# EAGLE design TriacSwitch2 (EAGLE 6.1)
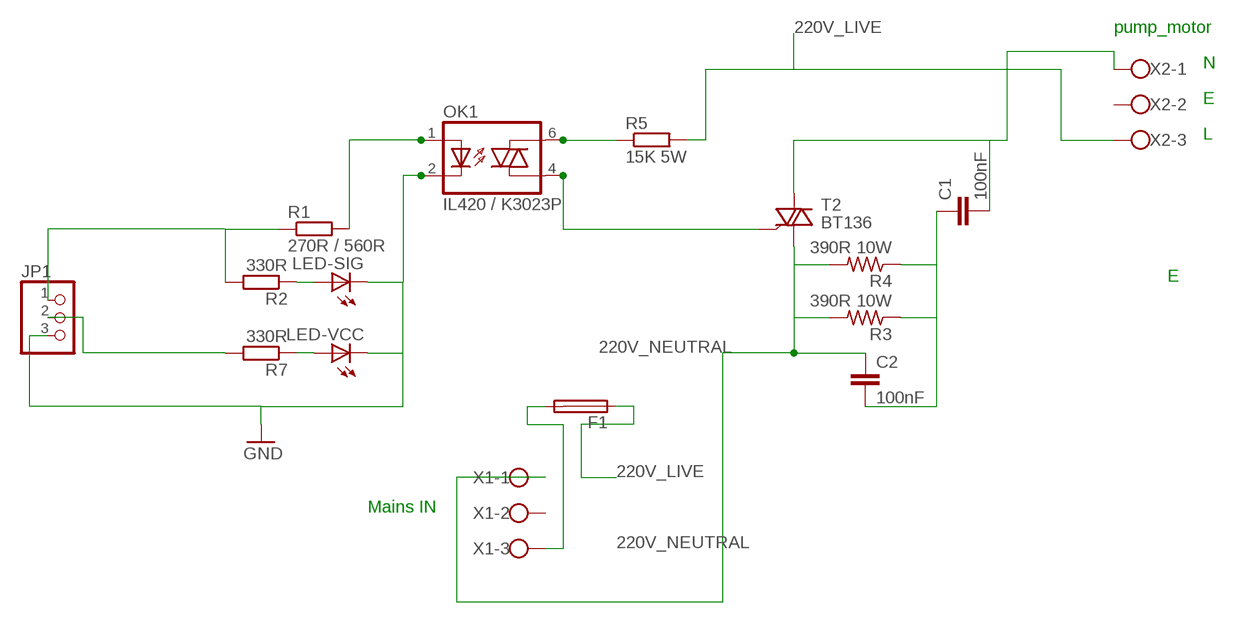
[diagram p0: schematic, sheet 1]

## Parts
C1  100nF  C-EU150-054X183  [C150-054X183]
C2  100nF  C-EU150-054X183  [C150-054X183]
F1  GSH15  [GSH15]
JP1  PINHD-1X3  [1X03]
LED-SIG  LED3MM  [LED3MM]
LED-VCC  LED3MM  [LED3MM]
OK1  IL420 / K3023P  IL420  [DIL06]
R1  270R / 560R  R-EU_0204/7  [0204/7]
R2  330R  R-EU_0204/7  [0204/7]
R3  390R 10W  R-US_0922/22  [0922/22]
R4  390R 10W  R-US_0922/22  [0922/22]
R5  15K 5W  R-EU_0617/22  [0617/22]
R7  330R  R-EU_0204/7  [0204/7]
T2  BT136  [TO220AB]
X1  W237-103  [W237-103]
X2  W237-103  [W237-103]

## Nets
220V_LIVE: F1.1 R5.2 X2.3
220V_NEUTRAL: C2.1 R3.2 R4.2 T2.1(A1) X1.1
GND: JP1.3 LED-SIG.K(C) LED-VCC.K(C) OK1.2(C)
N$1: OK1.4(A1) T2.3(G)
N$2: F1.2 X1.3
N$3: JP1.1 R1.1 R2.2
N$4: LED-SIG.A R2.1
N$6: OK1.6(A2) R5.1
N$7: C1.1 C2.2 R3.1 R4.1
N$8: OK1.1(A) R1.2
N$9: LED-VCC.A R7.1
N$10: JP1.2 R7.2
N$11: C1.2 T2.2(A2) X2.1
Unconnected: X1.2 X2.2

## Notes on the sheet
- pump_motor
- N
- E
- L
- E
- Mains IN

## Library data of the parts
C1 C2 = rcl:C-EU: CAPACITOR, European symbol
F1 = fuse:GSH15: FUSE HOLDER grid 15mm, 19649 Wickmann; MPN: 64900001039; OC_FARNELL: 1271673; OC_NEWARK: 02P0318
JP1 = pinhead:PINHD-1X3: PIN HEADER
LED-SIG LED-VCC = led:LED: LED OSRAM: - CHIPLED LG R971, LG N971, LY N971, LG Q971, LY Q971, LO R971, LY R971 LH N974, LH R974 LS Q976, LO Q976, LY Q976 LO Q996 - Hyper CHIPLED LW Q18S LB Q993, LB Q99A, LB R99A - SideLED LS A670, LO A670, LY A670, LG A670, LP A670 LB A673, LV A673, LT A673, LW A673 LH A674 LY A675 LS A676, LA A676, LO A676, LY A676, LW A676 LS A679, LY A679, LG A679 - Hyper Micro SIDELED® LS Y876, LA Y876, LO Y876, LY Y876 LT Y87S - SmartLED LW L88C, LW L88S LB L89C, LB L89S, LG L890 LS L89K, LO L89K, LY L89K LS L896, LA L896, LO L896, LY L896 - TOPLED LS T670, LO T670, LY T670, LG T670, LP T670 LSG T670, LSP T670, LSY T670, LOP T670, LYG T670 LG T671, LOG T671, LSG T671 LB T673, LV T673, LT T673, LW T673 LH T674 LS T676, LA T676, LO T676, LY T676, LB T676, LH T676, LSB T676, LW T676 LB T67C, LV T67C, LT T67C, LS T67K, LO T67K, LY T67K, LW E67C LS E67B, LA E67B, LO E67B, LY E67B, LB E67C, LV E67C, LT E67C LW T67C LS T679, LY T679, LG T679 LS T770, LO T770, LY T770, LG T770, LP T770 LB T773, LV T773, LT T773, LW T773 LH T774 LS E675, LA E675, LY E675, LS T675 LS T776, LA T776, LO T776, LY T776, LB T776 LHGB T686 LT T68C, LB T68C - Hyper Mini TOPLED® LB M676 - Mini TOPLED Santana® LG M470 LS M47K, LO M47K, LY M47K Source: http://www.osram.convergy.de LUXEON: - LUMILED® LXK2-PW12-R00, LXK2-PW12-S00, LXK2-PW14-U00, LXK2-PW14-V00 LXK2-PM12-R00, LXK2-PM12-S00, LXK2-PM14-U00 LXK2-PE12-Q00, LXK2-PE12-R00, LXK2-PE12-S00, LXK2-PE14-T00, LXK2-PE14-U00 LXK2-PB12-K00, LXK2-PB12-L00, LXK2-PB12-M00, LXK2-PB14-N00, LXK2-PB14-P00, LXK2-PB14-Q00 LXK2-PR12-L00, LXK2-PR12-M00, LXK2-PR14-Q00, LXK2-PR14-R00 LXK2-PD12-Q00, LXK2-PD12-R00, LXK2-PD12-S00 LXK2-PH12-R00, LXK2-PH12-S00 LXK2-PL12-P00, LXK2-PL12-Q00, LXK2-PL12-R00 Source: www.luxeon.com KINGBRIGHT: KA-3528ASYC Source: www.kingbright.com
OK1 = optocoupler:IL420: SIEMENS OPTO COUPLER; MF: VISHAY/TELEFUNKEN; MPN: IL420; OC_FARNELL: 1469561; OC_NEWARK: 58K1719
R1 R2 R5 R7 = rcl:R-EU_: RESISTOR, European symbol
R3 R4 = resistor:R-US_: RESISTOR, American symbol
T2 = triac:BT136: Triac BT136 series E sensitive gate Source: http://www.nxp.com/acrobat_download/datasheets/BT136_SERIES_E_2.pdf
X1 X2 = con-wago-500:W237-103: WAGO SCREW CLAMP; MPN: 237-103; OC_FARNELL: unknown; OC_NEWARK: 18M7116

## Board
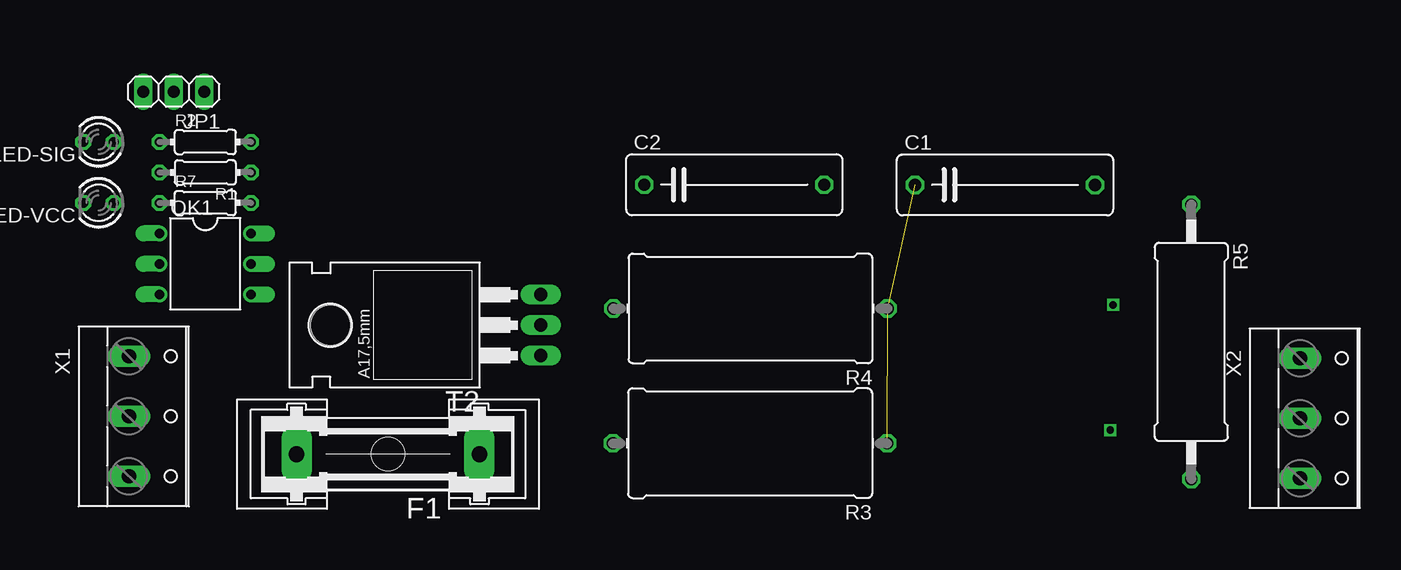
[diagram p1: board, top side]
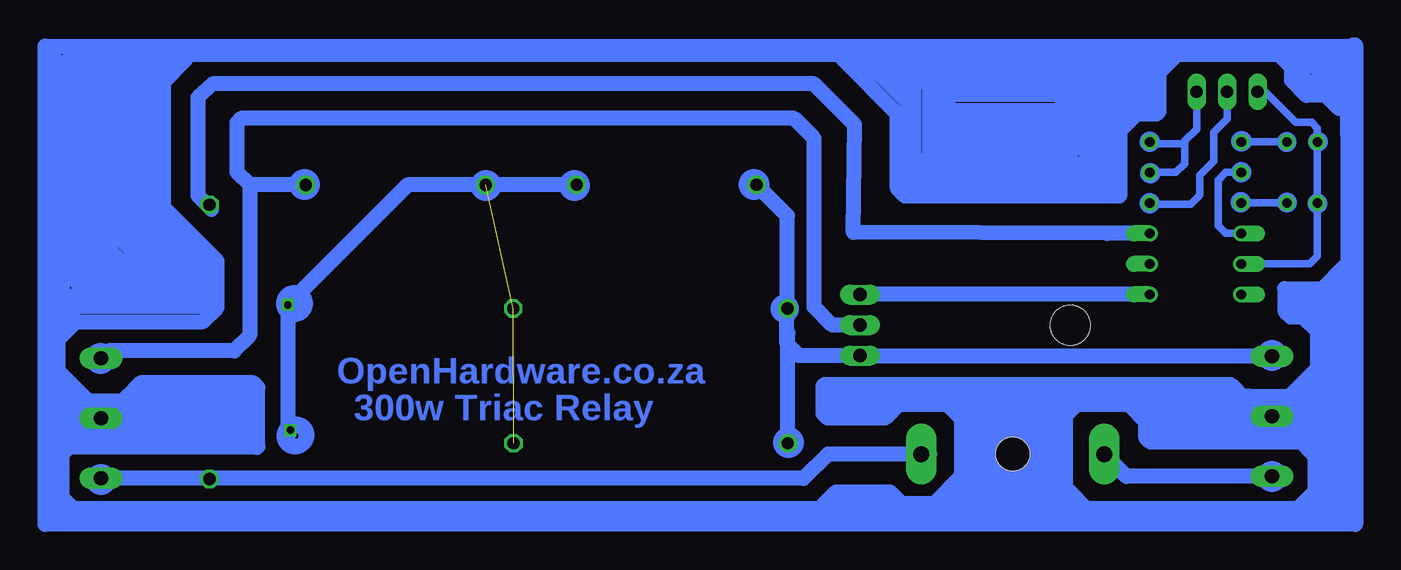
[diagram p2: board, bottom side, seen from below]

No outline drawn. Coordinates in mm, seen from the top.
Copper layers (1*16): Top 0.035mm / dielectric 1.5mm / Bottom 0.035mm
Design rules: minimum track width 10mil, minimum drill 24mil, track to track 8mil, track to pad 8mil, pad to pad 8mil, via to via 8mil, smd to smd 8mil, copper to edge 40mil, drill to drill 8mil, minimum pad ring 10mil, minimum via ring 8mil, stop-mask expansion 4mil, vias tented up to drill 0mil, thermal gap 10mil

### Footprints (pad centres in the part's own frame; a part is rotated, then mirrored left to right if it is on the bottom)
C150-054X183 = drill 1.016 octagon: 1 -7.493,0; 2 7.493,0
GSH15 = drill 1.321 pad 2.54 long: 1 -7.62,0; 2 7.62,0 | hole 2.794: 0,0
1X03 = drill 1.016 long: 1 -2.54,0; 2 0,0; 3 2.54,0
LED3MM = drill 0.813 octagon: A -1.27,0; K 1.27,0
DIL06 = drill 0.813 offset: 1 -2.54,-3.81; 2 0,-3.81; 3 2.54,-3.81; 4 2.54,3.81; 5 0,3.81; 6 -2.54,3.81
0204/7 = drill 0.813 octagon: 1 -3.81,0; 2 3.81,0
0922/22 = drill 1.016 octagon: 1 -11.43,0; 2 11.43,0
0617/22 = drill 1.016 octagon: 1 -11.43,0; 2 11.43,0
TO220AB = drill 1.118 long: 1 -2.54,-6.35; 2 0,-6.35; 3 2.54,-6.35 | hole 3.302: 0,11.176
W237-103 = drill 1.194 long: 1 -5,-1.29; 2 0,-1.29; 3 5,-1.29

### Placement (x,y rotation side)
C1  65.37,40.87 0 top
C2  42.81,40.89 0 top
F1  13.95,18.44 180 top
JP1  -3.9,48.64 180 top
LED-SIG  -10.16,44.45 180 top
LED-VCC  -10.16,39.37 180 top
OK1  -1.27,34.29 270 top
R1  -1.27,41.91 180 top
R2  -1.27,44.45 0 top
R3  44.13,19.34 180 top
R4  44.16,30.57 180 top
R5  80.9,27.79 270 top
R7  -1.27,39.37 0 top
T2  20.33,29.19 90 top
X1  -6.35,21.59 270 top
X2  91.24,21.43 270 top

### Tracks (layer width: path | path; a pad name or v marks a point on that pad's centre or on a via)
220V_LIVE
  Bottom 1.27: F1.1 29.35,18.44 31.38,16.41 80.55,16.41 | 80.55,16.41 89.93,16.41 X2.3 | R5.2 80.72,16.24 80.55,16.41
220V_NEUTRAL
  Bottom 1.27: T2.1 26.27,26.65 26.03,26.41 | X1.1 26.62,26.59 T2.1 | T2.1 31.79,26.65 32.78,27.64 32.78,28.6 | 32.78,28.6 32.78,30.52 R4.2 32.73,38.3 C2.1 | R3.2 32.7,28.52 32.78,28.6
GND
  Bottom 0.61: OK1.2 -10.79,34.29 -11.43,34.92 LED-VCC.K LED-SIG.K -11.43,45.6 -10.96,46.08 -9.64,46.08 -7.08,48.64 JP1.3
N$1
  Bottom 1.27: OK1.4 26.66,31.75 T2.3
N$2
  Bottom 1.27: X1.3 4.49,16.59 F1.2
N$3
  Bottom 0.61: JP1.1 -1.36,45.53 -0.36,44.54 | -0.36,44.54 -0.15,44.32 2.41,44.32 R2.2 | R1.1 0.36,41.91 -0.36,42.64 -0.36,44.54
N$4
  Bottom 0.61: LED-SIG.A R2.1
N$6
  Bottom 1.27: OK1.6 6.11,36.83 27.25,36.92 27.14,45.9 30.52,49.29 80.64,49.29 81.87,48.17 81.87,39.97 80.72,38.83 R5.1
N$7  (2 unrouted)
  Bottom 1.27: C2.2 57.86,40.89 C1.1 64.39,40.87 74.38,30.87 74.38,19.81
N$8
  Bottom 0.61: R1.2 -3.81,41.91 -3.17,41.27 -3.17,37.47 -3.81,36.83 OK1.1
N$9
  Bottom 0.61: LED-VCC.A R7.1
N$10
  Bottom 0.61: JP1.2 -3.9,46.39 -2.77,45.27 -2.77,42.86 -1.61,41.69 -1.61,40.01 -0.88,39.27 2.44,39.27 R7.2
N$11
  Bottom 1.27: T2.2 28.98,29.19 30.5,30.71 30.5,44.75 32.17,46.41 78.27,46.41 78.62,46.06 78.62,41.94 77.55,40.87 | C1.2 77.55,40.87 | 77.55,40.87 77.55,28.32 78.82,27.05 89.33,27.05 X2.1
N$12  (via drill 0.6)
  other vias: 74.15,20.44
N$13
  Bottom 1.27: 74.38,30.98 74.38,20.02
N$15  (via drill 0.6)
  other vias: 74.38,30.87
N$16
  Bottom 1.27: -12.07,13.26 93.89,13.08 94.31,14.13 94.31,49.85 92.21,51.78 -13.15,51.78 -13.94,51.34 -14.02,13.25 -12.01,13.24
N$17
  Bottom 1.27: -8.95,13.53 -9.43,13.53 -11.26,15.35 -11.26,18.28 -9.92,19.62 -5.78,19.62 -5.17,20.23 -5.17,22.79 -5.66,23.27 -9.13,23.27 -11.44,25.59 -11.44,28.64 -10.22,29.85 -9.19,29.85 -8.76,30.28 -8.76,32.17 -8.7,32.23 -11.87,32.23 -13.76,34.12 -13.76,32.96 -12.17,31.38 -9.49,31.38 -9.37,31.25 -9.37,31.07 -9.74,30.71 -10.77,30.71 -11.08,30.4 -11.08,30.1 -12.05,29.12 -12.05,30.59 -11.69,30.95 -12.05,30.95 -12.78,31.68 -12.78,14.5 -13.09,14.2 -11.14,14.2 -10.96,14.01 -10.96,14.14 -11.99,15.17 -11.99,28.51 -11.93,28.57 -11.93,24.73 -9.98,22.79 -6.45,22.79 -5.84,22.18 -5.84,20.59 -5.96,20.47 -10.35,20.47 -11.44,19.37 -11.44,22.6 -11.02,23.03 -11.02,21.14 -11.08,21.08 -10.83,21.08 -10.53,21.39 -10.53,21.81 | -10.53,22.3 -10.53,21.81 | -10.53,21.81 -10.04,21.32 -6.7,21.32 -6.63,21.39 -6.63,22.36 -6.76,22.48 -9.25,22.48 -9.74,21.99 -9.74,21.93 -10.16,21.51 -10.16,21.26
N$18
  Bottom 1.27: -11.68,13.9 92.27,13.9 93.43,15.06 93.43,18.22 92.38,19.27 87.33,19.27 86.69,19.91 86.69,22.43 87.12,22.86 91.01,22.86 93.85,25.7 93.85,14.26 93.18,13.59 93.18,23.88 93.12,23.94 93.12,23.76 91.42,22.05 87.82,22.05 87.58,21.81 87.58,20.41 87.89,20.11 92.45,20.11 92.51,20.17 92.51,20.9 92.57,20.96 92.57,21.87 | 92.57,22.79 92.57,21.87 | 92.57,21.87 91.84,21.14 91.29,21.14 | 91.29,21.14 91.05,20.9 88.68,20.9 88.68,20.96 88.8,21.08 91.23,21.08 91.29,21.14
N$19
  Bottom 1.27: 76.93,19.01 92.88,19.01 93.12,19.25
N$20
  Bottom 1.27: 76.87,19.07 76.87,24 77.23,24.37 86.67,24.37 87.76,23.27
N$21
  Bottom 1.27: 77.54,23.39 86.3,23.39 86.67,23.03 78.09,23.03 77.17,22.12 86.42,22.12 86.48,22.05 86.48,21.81 86.06,21.39 77.9,21.39 77.48,20.96 77.48,20.84 77.42,20.78 86.18,20.78 86.3,20.65 86.3,20.47 86.36,20.41 78.27,20.41 77.72,19.86 87.64,19.86 87.95,19.56
N$22
  Bottom 1.27: 93.49,24.5 93.49,28.01 92.03,29.47 81.44,29.47 80.27,30.64 80.27,34.53 84.72,38.98 84.72,49.44 82.9,51.27
N$23
  Bottom 1.27: 83.78,51.2 84.58,51.2 85.75,50.02
N$24
  Bottom 1.27: 85.75,49.95 85.75,38.9 80.93,34.08 80.93,31.01 81.22,30.72 91.95,30.72 93.71,28.96 93.71,49 91.59,51.12 87.06,51.12 86.55,50.61 86.55,38.32 81.66,33.42 81.66,31.96 81.95,31.67 92.25,31.67 93.12,30.79 93.12,48.27 90.71,50.68 85.97,50.68 85.67,50.98 86.69,50.98 87.65,50.02 87.65,38.32 82.17,32.84 91.81,32.84 91.95,32.69 91.95,49.15 90.86,49.15 90.2,49.81 89.54,49.81 | 88.3,49.81 89.54,49.81 | 89.54,49.81 90.5,48.85 90.5,48.2 91.37,47.32 91.37,34.23 90.35,33.2 84.14,33.2 83.99,33.35 83.99,33.36 88.67,38.03 88.67,48.56 88.3,48.93 90.49,48.93 90.79,48.64 90.79,48.05 91.01,47.83 89.62,47.83 89.55,47.9 89.55,37.59 85.75,33.79 89.98,33.79 | 89.98,33.79 90.2,33.79 90.93,34.52 90.93,46.88 90.86,46.88 90.5,47.25 90.5,34.16 90.42,34.08 87.79,34.08 87.35,34.52 88.3,34.52 88.96,35.18 88.96,35.25 89.47,35.76 | 89.47,35.76 89.47,36.57 | 89.47,35.76 89.47,34.01 89.18,33.72 89.91,33.72 89.98,33.79 | 89.98,33.79 89.98,34.89 89.84,35.03
N$25
  Bottom 1.27: 7.08,51.71 7.08,51.56 5.55,50.02 5.55,46.95 5.04,46.44 4.02,46.44 3.43,47.03 1.9,47.03 1.83,46.95 1.83,50.17 0.44,51.56
N$26
  Bottom 1.27: 1.24,51.41 2.04,51.41 2.77,50.68 2.77,48.2 2.85,48.12 3.87,48.12 4.46,47.54 4.46,50.17 5.41,51.12 3.8,51.12 3.65,50.98 3.65,48.93 3.58,48.85
N$27
  Bottom 1.27: -13.95,47.25 -13.22,47.25 -12.12,48.34 -10.52,48.34 -9.28,49.59 -9.28,50.69 -8.4,51.56 -9.35,51.56 -10.15,50.76 -10.15,49.88 -10.59,49.44 -12.71,49.44 -13.22,48.93 -13.22,48.12 -13.37,47.98 -13.37,50.1 -13.07,50.39 -13.07,50.76 -12.86,50.98 -12.12,50.98 -12.05,51.05 -11.83,51.05 -11.32,50.54 -11.39,50.54 -11.9,50.02 -11.98,50.02 -12.05,50.1 -12.05,50.17 -11.47,50.76 | -11.47,50.76 | -11.47,50.76 -11.1,51.12
N$28
  Bottom 1.27: -14.39,52.51 -14.61,52.51 -14.61,12.58 94.58,12.58 94.58,52.44 -14.54,52.44 -14.54,51.34
N$29
  Bottom 1.27: 93.64,51.2 93.85,51.2 93.85,51.78
N$30
  Bottom 1.27: 4.52,47.85 5.05,47.85 5.05,39.95 22.93,39.95 23.57,40.58 23.57,46.8 28.09,51.33 26.31,51.33 22.73,47.75 22.73,40.89 22.62,40.79 6,40.79 5.89,40.9 5.89,49.33 7.68,51.12 24.41,51.12 24.51,51.01 24.41,51.01 22.2,48.8 22.2,42.26 21.67,41.74 7.16,41.74 6.94,41.95 6.94,49.01 8.42,50.49 22.3,50.49 22.62,50.8 20.94,49.12 20.94,42.9 20.62,42.58 8.21,42.58 7.79,43 7.79,48.59 8.84,49.64 19.67,49.64 20.41,50.38 20.41,44.37 19.67,43.63 9.15,43.63 9.05,43.53 9.05,45.22 | 9.05,45.22 9.05,48.8 9.36,49.12 19.57,49.12 19.67,49.22 19.67,44.9 19.46,44.69 9.26,44.69 9.15,44.58 9.15,47.33 10.21,48.38 19.15,48.38 19.36,48.17 19.36,47.22 19.25,47.11 10.1,47.11 9.68,47.53 9.68,46.8 9.57,46.69 19.36,46.69 19.36,46.06 19.57,45.85 8.84,45.85 8.84,45.43 9.05,45.22 | 9.05,45.22 17.68,45.22 17.78,45.11 5.32,45.11 3.64,46.79 1.97,46.79 1.76,46.99 1.76,50.55 1.91,50.69
N$31
  Bottom 1.27: 18.51,43.65 20.54,43.65 21.66,42.53
N$32
  Bottom 1.27: -9.86,19.8 -11.02,19.8 -11.08,19.86 -11.32,19.86 -11.75,19.43 2.5,19.43 2.86,19.8 2.86,21.14 4.26,22.54 23.49,22.54 24.59,21.45 29.4,21.45 29.76,21.81 29.76,24.13 29.64,24.25 -4.2,24.25 -5.42,23.03 -3.71,23.03 | 24.41,23.03 28.79,23.03 29.03,23.27 29.03,22.85 28.79,22.6 25.2,22.6 24.89,22.3 24.89,22.54 24.41,23.03 | 24.41,23.03 -3.71,23.03 | -3.71,23.03 -4.44,22.3 2.49,22.3 3.41,23.21 3.41,22.6 2.5,21.69 -4.57,21.69 -4.69,21.57 -4.69,21.32 -4.81,21.2 2.5,21.2 2.56,21.14 2.56,20.71 2.25,20.41 -6.03,20.41
N$33
  Bottom 1.27: 4.38,13.52 7.45,13.52 9.55,15.62 9.55,21.68 8.41,22.82 19.64,22.82 | 20.07,22.82 19.64,22.82 | 19.64,22.82 18.23,21.41 18.23,16.58 20.69,14.13 19.2,14.13 17.71,15.62 17.71,21.94 17.62,22.03 17.18,22.03 17,22.2 17,14.83 17.18,14.66 17.36,14.66 17.44,14.57 10.17,14.57 | 9.73,14.57 10.17,14.57 | 10.17,14.57 10.61,15.01 10.61,21.77 10.52,21.85 16.65,21.85 16.65,15.8 15.78,14.92 11.66,14.92 11.22,15.36 11.22,20.8 11.39,20.98 15.87,20.98 15.95,21.06 15.95,15.53 15.43,15.01 12.18,15.01 11.83,15.36 11.83,19.57 12.36,20.1 14.9,20.1 14.9,15.88 14.64,15.62 12.62,15.62 12.62,20.01 12.97,20.36 13.94,20.36 13.94,16.68 13.59,16.32 | 13.59,16.32 | 13.59,16.32 13.32,16.59 13.32,20.36 13.67,20.71 13.59,20.71 12.88,20.01 12.88,18.61 12.97,18.52
N$34
  Bottom 1.27: 19.94,14.29 23.2,14.29 24.17,15.26 28.69,15.26 29.83,14.12 28.78,14.12 28.35,14.54 24.76,14.54 24.63,14.42
(copper drawn outside any net)
  shapes: Bottom circle x24

### Text on the board
Bottom: OpenHardware.co.za | 300w Triac Relay